# EasyEDA Pro project ProProject_MSPM0电赛_2025-06-29.epro

# Schematic Schematic1
Board Name: Board1; Create Date: 2025-06-14; Page Name: P1; Project Name: MSPM0电赛; Schematic Name: Schematic1; Update Date: 2025-06-28; Company: 嘉立创EDA; Page Size: A4; Version: V1.0
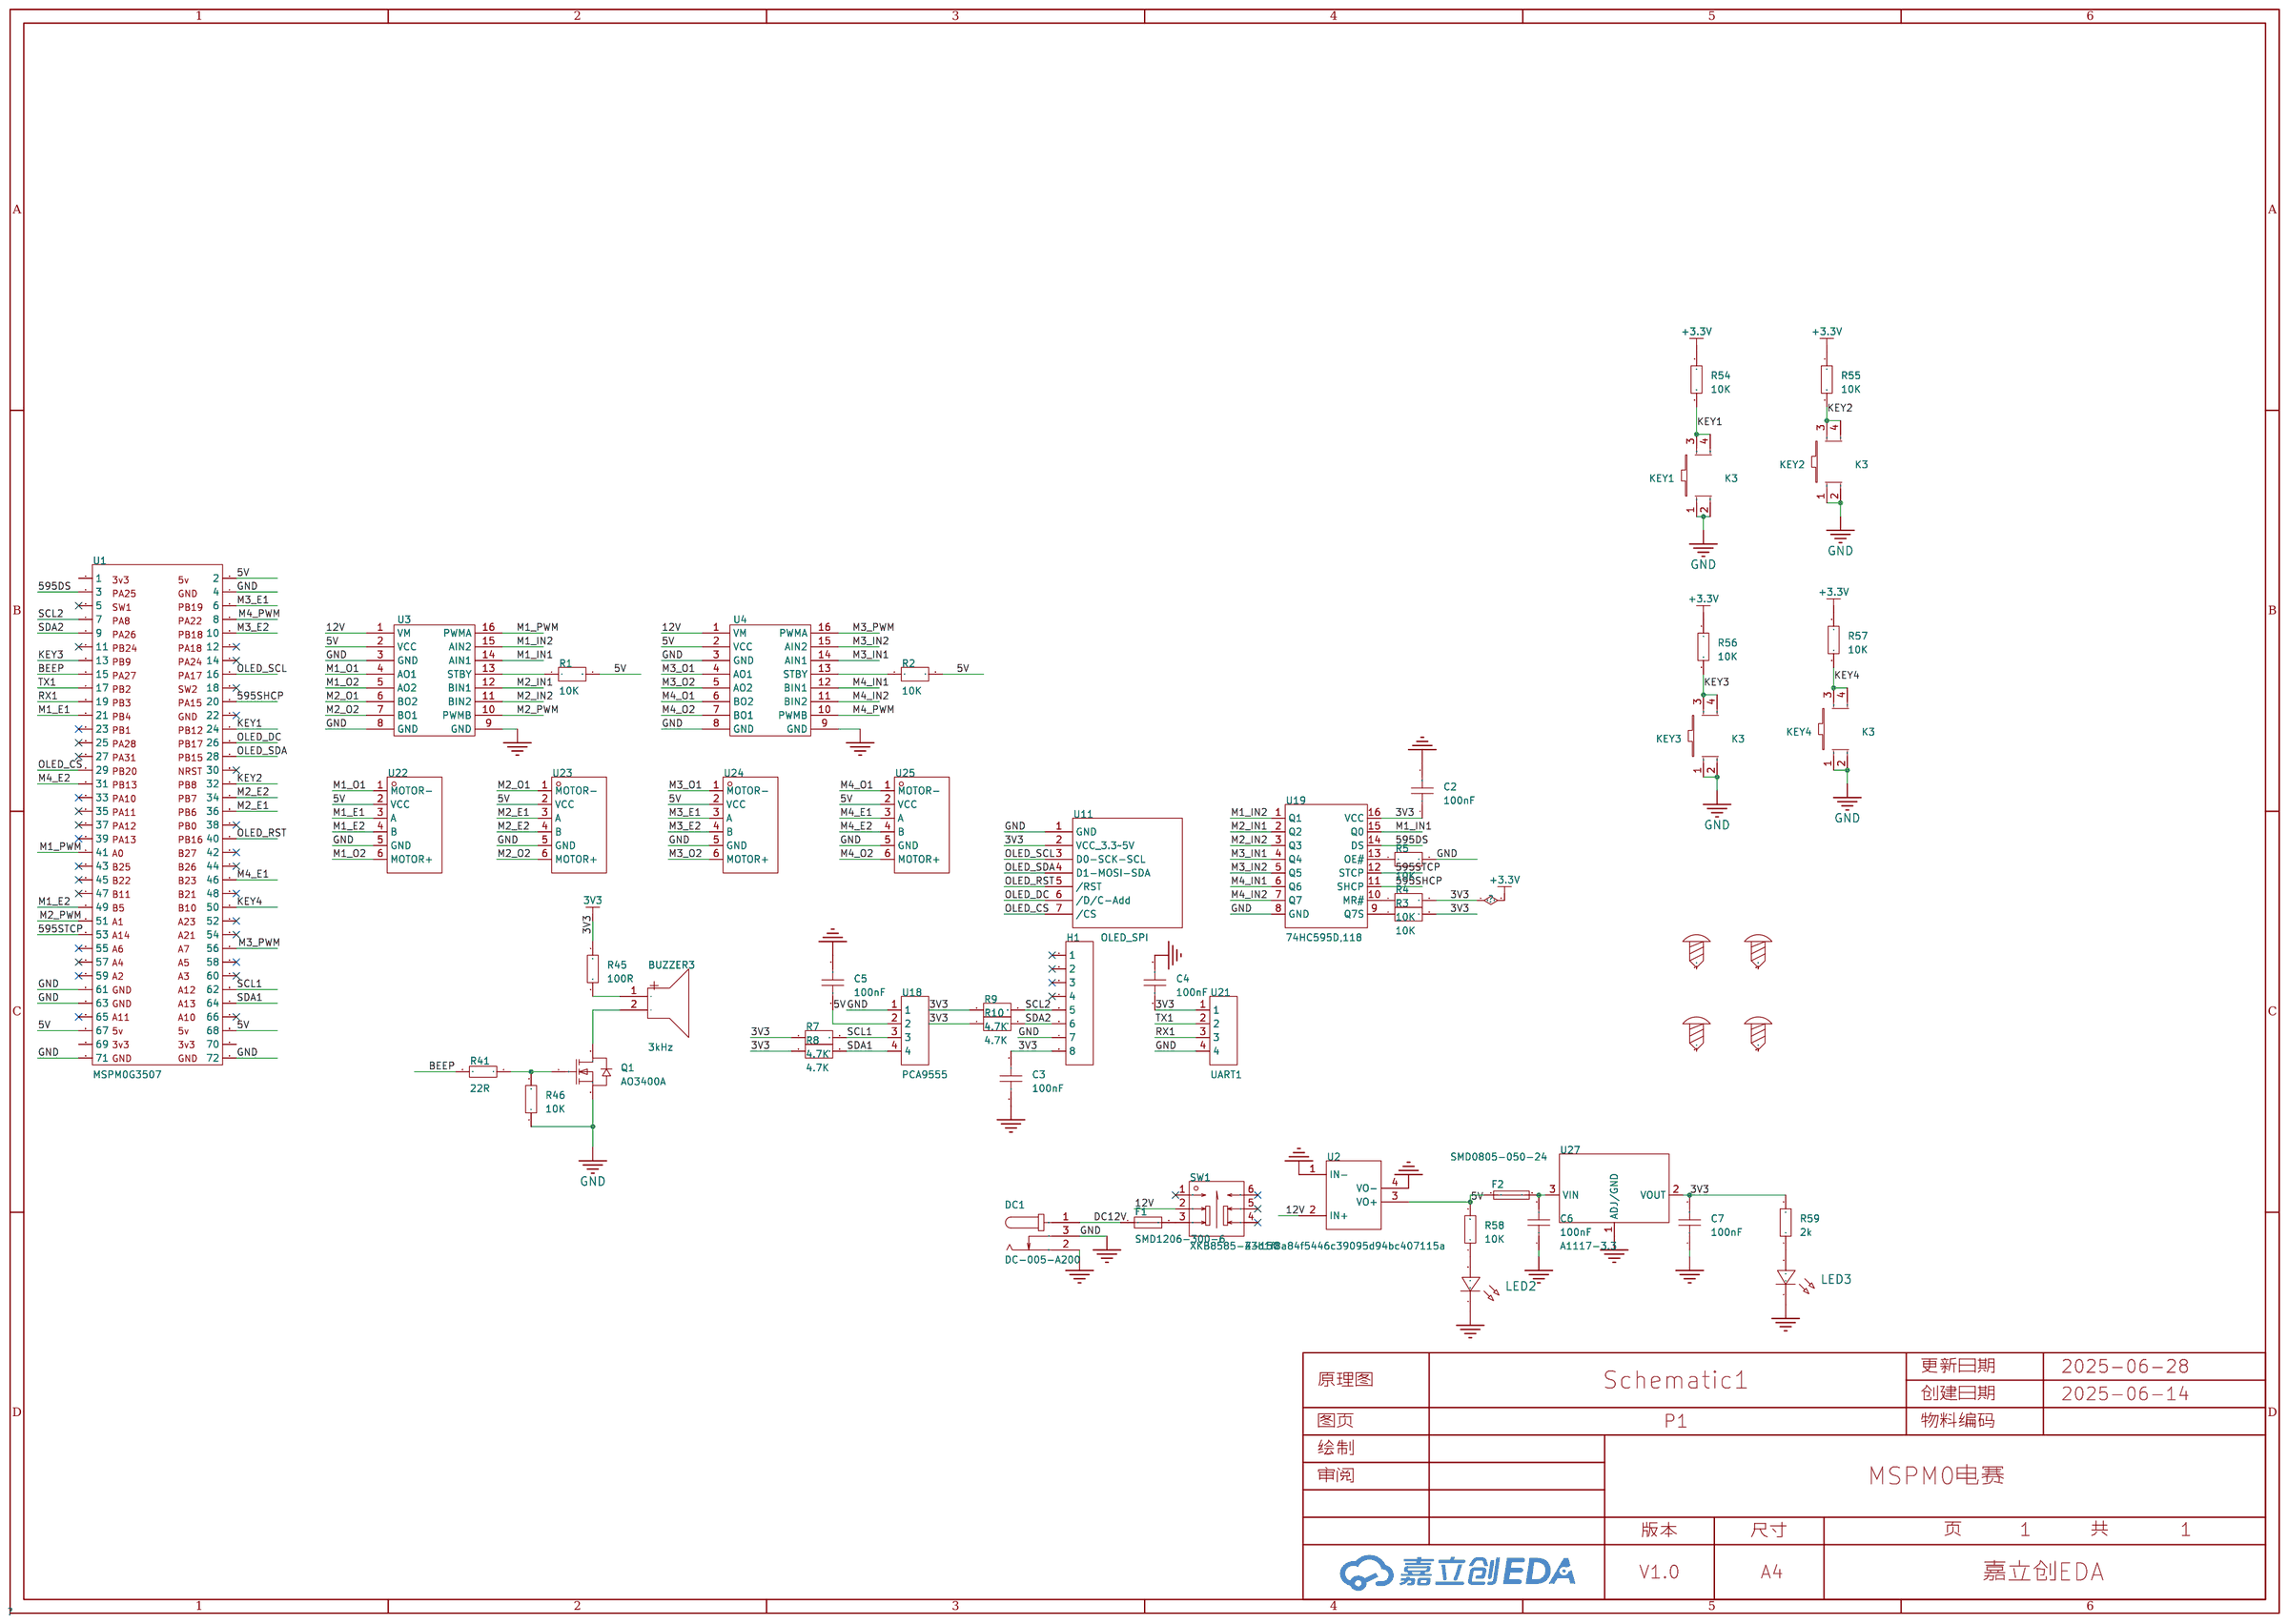
[diagram p0: schematic sheet]

## Parts
BUZZER3  3kHz  [BUZ-TH_BD9.0-P5.00-D0.6-FD]
C2  100nF  [C0603]
C3  100nF  [C0603]
C4  100nF  [C0603]
C5  100nF  [C0603]
C6  100nF  [C0603]
C7  100nF  [C0603]
DC1  DC-005-A200  [DC-IN-TH_DC-005-A200]
F1  SMD1206-300-6  [F1206]
F2  SMD0805-050-24  [F0805]
H1  -  [HDR-TH_8P-P2.54-V-F-1]
KEY1  K3  [KEY-TH_4P-L6.0-W6.0-P4.50]
KEY2  K3  [KEY-TH_4P-L6.0-W6.0-P4.50]
KEY3  K3  [KEY-TH_4P-L6.0-W6.0-P4.50]
KEY4  K3  [KEY-TH_4P-L6.0-W6.0-P4.50]
LED2  -  [LED_0603]
LED3  -  [LED_0603]
Q1  AO3400A  [SOT-23-3_L2.9-W1.3-P1.90-LS2.4-BR]
R1  10K  [C0603]
R2  10K  [C0603]
R3  10K  [C0603]
R4  10K  [C0603]
R5  10K  [C0603]
R7  4.7K  [C0603]
R8  4.7K  [C0603]
R9  4.7K  [C0603]
R10  4.7K  [C0603]
R41  22R  [R0603]
R45  100R  [R0603]
R46  10K  [R0603]
R54  10K  [R0603]
R55  10K  [R0603]
R56  10K  [R0603]
R57  10K  [R0603]
R58  10K  [R0603]
R59  2k  [R0603]
SCREW1  -  [M3螺丝]
SCREW2  -  [M3螺丝]
SCREW3  -  [M3螺丝]
SCREW4  -  [M3螺丝]
SW1  XKB8585-Z-150  [SW-TH_6P-L8.5-W8.5-P2.50-LS5.4-BL-1]
U1  MSPM0G3507  [MSPM0G3507]
U2  43b1f8a84f5446c39095d94bc407115a  [AJ41 DC-DC降压电源模块]
U3  -  [TB6612]
U4  -  [TB6612]
U11  OLED_SPI  [0.96OLED_7P]
U18  PCA9555  [CONN-TH_4P-P2.50-XH2.54-4P]
U19  74HC595D,118  [SOIC-16_L9.9-W3.9-P1.27-LS6.0-BL]
U21  UART1  [CONN-TH_4P-P2.50-XH2.54-4P]
U22  -  [ZX-XH2.54-6PWZ]
U23  -  [ZX-XH2.54-6PWZ]
U24  -  [ZX-XH2.54-6PWZ]
U25  -  [ZX-XH2.54-6PWZ]
U27  A1117-3.3  [SOT-223-3_L6.5-W3.4-P2.30-LS7.0-BR-1]

## Library data of the parts
BUZZER3 = HNB09A03: 驱动方式:有源(内含驱动线路);构造类型:电磁式;频率:3kHz;声压(SPL):85dB;; LCSC Part Name: 电磁式有源一体蜂鸣器HNB09A03; Supplier Part: C96102; Manufacturer: 华能; Supplier Footprint: 插件,D=9mm; JLCPCB Part Class: 扩展库; Datasheet: https://atta.szlcsc.com/upload/public/pdf/source/20241128/61C4C8C3938BB25F7C38FBE94CCE8DCF.pdf; Supplier: LCSC; Driver Circuitry: 有源(内含驱动线路); Technology: 电磁式; Voltage - Supply: 1.5V~4.5V; Current Consumption: 30mA; Sound Pressure Level(SPL): 85dB; Diameter(φD): 9mm; Height: 5.5mm; Operating Temperature: -20℃~+70℃
C2-C7 = CAP_0603: Supplier Footprint: 0603
DC1 = DC-005-A200: 连接器类型:DC电源插座;安装方式:弯插;触点内径:2mm;触点外径:6.4mm;额定电流:3A;额定电压:30V;工作温度范围:-20℃~+70℃;; LCSC Part Name: DC电源插座 内径:2mm 外径:6.4mm; Supplier Part: C720557; Manufacturer: XUNPU(讯普); Supplier Footprint: 插件; JLCPCB Part Class: 扩展库; Datasheet: https://atta.szlcsc.com/upload/public/pdf/source/20200812/C720557_2286DFCD6C75B71AF905731F627ABF3A.pdf; Supplier: LCSC; Connector Type: DC电源插座; Mounting Style: 弯插; Inside Contact Diameter: 2mm; Outside Contact Diameter: 6.4mm; Current Rating (Max): 3A; Voltage Rating (Max): 30V; Operating Temperature Range: -20℃~+70℃
F1 = SMD1206-300-6: 耐压(Vmax):6V;最大电流(Imax):40A;保持电流(Ihold):3A;跳闸电流(Itrip):6A;; Supplier Part: C46641035; Manufacturer: 宏嘉诚; Supplier Footprint: 1206; JLCPCB Part Class: 扩展库; Datasheet: https://atta.szlcsc.com/upload/public/pdf/source/20250414/5AC46D2F961B725C9DB708C91B04DBEC.pdf; Supplier: LCSC; Voltage - Max: 6V; Current - Max: 40A; Hold Current: 3A; Trip Current: 6A; Power Dissipation: 1W; Resistance - Initial (Ri) (Min): 10mΩ; Resistance - Post Trip (R1) (Max): 50mΩ; Time to Trip(Max): 4s
F2 = SMD0805-050-24: 耐压(Vmax):24V;最大电流(Imax):40A;保持电流(Ihold):500mA;跳闸电流(Itrip):1A;; Supplier Part: C46640987; Manufacturer: 宏嘉诚; Supplier Footprint: 0805; JLCPCB Part Class: 扩展库; Datasheet: https://atta.szlcsc.com/upload/public/pdf/source/20250414/C7C75E40B18789A4A1352E9E468D2637.pdf; Supplier: LCSC; Voltage - Max: 24V; Current - Max: 40A; Hold Current: 500mA; Trip Current: 1A; Power Dissipation: 500mW; Resistance - Initial (Ri) (Min): 100mΩ; Resistance - Post Trip (R1) (Max): 850mΩ; Time to Trip(Max): 100ms; Operating Temperature: -40℃~+85℃
H1 = HDR-F_2.54_1x8P: Supplier Part: C27438; Supplier Footprint: 插件
KEY1-KEY4 = 按键开关6*6*8.5: LCSC Part Name: 按键开关6*6*8.5   直插; Supplier Part: C59980; Supplier Footprint: 插件; JLCPCB Part Class: 扩展库; Supplier: LCSC
LED2 LED3 = LED_0603-R: Supplier Footprint: 0603
Q1 = AO3400A_C20917: 类型:1个N沟道;漏源电压(Vdss):30V;连续漏极电流(Id):5.7A;导通电阻(RDS(on)@Vgs,Id):26.5mΩ@10V,5.7A;功率(Pd):1.4W;阈值电压(Vgs(th)@Id):1.5V@250uA;; LCSC Part Name: 1个N沟道 耐压:30V 电流:5.7A; Supplier Part: C20917; Manufacturer: AOS; Supplier Footprint: SOT-23-3L; JLCPCB Part Class: 基础库; Datasheet: https://atta.szlcsc.com/upload/public/pdf/source/20140107/1457706668533.pdf; Supplier: LCSC; Type: 1个N沟道; Drain Source Voltage (Vdss): 30V; Continuous Drain Current (Id): 5.7A; Drain Source On Resistance (RDS(on)@Vgs,Id): 26.5mΩ@10V,5.7A; Power Dissipation (Pd): 1.4W; Gate Threshold Voltage (Vgs(th)@Id): 1.5V@250uA; Total Gate Charge (Qg@Vgs): 7nC@4.5V; Input Capacitance (Ciss@Vds): 630pF@15V; Operating Temperature: -55℃~+150℃@(Tj)
R1-R5 R7-R10 = RGT1608P-4990-B-T5: 电阻类型:薄膜电阻;阻值:499Ω;精度:±0.1%;功率:62.5mW;最大工作电压:100V;温度系数:±25ppm/℃;; LCSC Part Name: 薄膜电阻 499Ω ±0.1% 62.5mW; Supplier Part: C2083102; Manufacturer: SUSUMU; Supplier Footprint: 0603; JLCPCB Part Class: 扩展库; Datasheet: https://atta.szlcsc.com/upload/public/pdf/source/20210602/FAF6903AD06801EB9B5BD9535AC54790.pdf; Supplier: LCSC; Type: 薄膜电阻; Tolerance: ±0.1%; Power(Watts): 62.5mW; Overload Voltage (Max): 100V; Temperature Coefficient: ±25ppm/℃; Operating Temperature Range: -55℃~+175℃
R41 R45 R46 R54-R59 = Res_0603: Supplier Footprint: 0603
SCREW1-SCREW4 = M3螺丝: Supplier Footprint: 插件
SW1 = XKB8585-Z-150: 电路结构:-;自锁/无锁:自锁;安装方式:直插;触点电流:100mA;额定电压 (AC):250V;额定电压 (DC):30V;带灯:不带;作用力:160gf;机械寿命:10万次;; LCSC Part Name: 按键开关   六脚 内扣 有声自锁; Supplier Part: C318850; Manufacturer: XKB Connectivity(中国星坤); Supplier Footprint: 插件; JLCPCB Part Class: 扩展库; Datasheet: https://atta.szlcsc.com/upload/public/pdf/source/20200227/C318850_BEC742BC33DEE736D7E5FB22B903A157.pdf; Supplier: LCSC; Self Lock / No Lock: 自锁; Actuator Style: 方形按钮; Mounting Style: 直插; Contact Current: 100mA; Voltage Rating (AC): 250V; Voltage Rating (DC): 30V; Insulation Resistance: 100MΩ; Actuator/Cap Color: 白色; With Lamp: 不带; Pin Style: PC引脚; Operating Force: 160gf; Operating Temperature: -15℃~+55℃; Mechanical Life: 10万次
U1 = MSPM0G3507: _: 3
U2 = AJ41 DC-DC降压电源模块: AJ41 DC-DC降压电源模块 6V-36V转5V
U3 U4 = TB6612
U11 = OLED_7P: Pin Type: IN
U18 U21 = XH2.54_4P_直插: Supplier Part: C9900008616; Supplier Footprint: XH2.54_4P; JLCPCB Part Class: 扩展库; Supplier: LCSC
U19 = 74HC595D,118: 功能:串行至串行或并行;电源电压:2V~6V;元件数:1;每个元件位数:8;; LCSC Part Name: 三态输出 串行至串行或并行移位寄存器; Supplier Part: C5947; Manufacturer: Nexperia(安世); Supplier Footprint: SOIC-16; JLCPCB Part Class: 基础库; Datasheet: https://atta.szlcsc.com/upload/public/pdf/source/20240724/C3A3241CA190230F407C83CEC4244600.pdf; Supplier: LCSC; Function: 串行至串行或并行; Supply Voltage: 2V~6V; Number of Elements: 1; Number of Bits per Element: 8; Output Type: 三态; Series: 74HC; Operating Temperature: -40℃~+125℃
U22-U25 = Motor-6Pin
U27 = A1117-3.3: 输出电流:1A;; LCSC Part Name: AMS1117-3.3; Supplier Part: C7432020; Manufacturer: IDCHIP(英锐芯); Supplier Footprint: SOT-223; JLCPCB Part Class: 扩展库; Datasheet: https://atta.szlcsc.com/upload/public/pdf/source/20230625/435FEEFA02C0FE449E7397A11F8448E0.pdf; Supplier: LCSC; Output Current: 1A; Features: 热关断(TSD)；过流保护(OCP)

## Nets
5V: C5.2 F2.1 R1.2 R2.2 R58.2 U1.2 U1.67 U1.68 U2.3(VO+) U3.2(VCC) U4.2(VCC) U18.2 U22.2(VCC) U23.2(VCC) U24.2(VCC) U25.2(VCC)
12V: SW1.2 U2.2(IN+) U3.1(VM) U4.1(VM)
+3.3V: C2.1 C3.2 C4.1 C7.2 H1.8 R3.2 R4.2 R7.1 R8.1 R9.1 R10.1 R45.1 R54.1 R55.1 R56.1 R57.1 R59.2 U11.2(VCC 3.3~5V) U19.16(VCC) U21.1 U27.2(VOUT)
GND: C2.2 C3.1 C4.2 C5.1 C6.1 C7.1 DC1.2 DC1.3 H1.7 KEY1.1 KEY1.2 KEY2.1 KEY2.2 KEY3.1 KEY3.2 KEY4.1 KEY4.2 LED2.1(C) LED3.1(C) Q1.2(S) R5.2 R46.1 U1.4 U1.61 U1.63 U1.71 U1.72 U2.1(IN-) U2.4(VO-) U3.3(GND) U3.8(GND) U3.9(GND) U4.3(GND) U4.8(GND) U4.9(GND) U11.1(GND) U18.1 U19.8(GND) U21.4 U22.5(GND) U23.5(GND) U24.5(GND) U25.5(GND) U27.1(ADJ/GND)
595DS: U1.3 U19.14(DS)
595SHCP: U1.20 U19.11(SHCP)
595STCP: U1.53 U19.12(STCP)
BEEP: R41.2 U1.15
DC12V: DC1.1 F1.1
KEY1: KEY1.3 KEY1.4 R54.2 U1.24
KEY2: KEY2.3 KEY2.4 R55.2 U1.32
KEY3: KEY3.3 KEY3.4 R56.2 U1.13
KEY4: KEY4.3 KEY4.4 R57.2 U1.50
M1_E1: U1.21 U22.3(A)
M1_E2: U1.49 U22.4(B)
M1_IN1: U3.14(AIN1) U19.15(Q0)
M1_IN2: U3.15(AIN2) U19.1(Q1)
M1_O1: U3.4(AO1) U22.1(MOTOR-)
M1_O2: U3.5(AO2) U22.6(MOTOR+)
M1_PWM: U1.41 U3.16(PWMA)
M2_E1: U1.36 U23.3(A)
M2_E2: U1.34 U23.4(B)
M2_IN1: U3.12(BIN1) U19.2(Q2)
M2_IN2: U3.11(BIN2) U19.3(Q3)
M2_O1: U3.6(BO2) U23.1(MOTOR-)
M2_O2: U3.7(BO1) U23.6(MOTOR+)
M2_PWM: U1.51 U3.10(PWMB)
M3_E1: U1.6 U24.3(A)
M3_E2: U1.10 U24.4(B)
M3_IN1: U4.14(AIN1) U19.4(Q4)
M3_IN2: U4.15(AIN2) U19.5(Q5)
M3_O1: U4.4(AO1) U24.1(MOTOR-)
M3_O2: U4.5(AO2) U24.6(MOTOR+)
M3_PWM: U1.56 U4.16(PWMA)
M4_E1: U1.46 U25.3(A)
M4_E2: U1.31 U25.4(B)
M4_IN1: U4.12(BIN1) U19.6(Q6)
M4_IN2: U4.11(BIN2) U19.7(Q7)
M4_O1: U4.6(BO2) U25.1(MOTOR-)
M4_O2: U4.7(BO1) U25.6(MOTOR+)
M4_PWM: U1.8 U4.10(PWMB)
OLED_CS: U1.29 U11.7(/CS)
OLED_DC: U1.26 U11.6(/D/C-Add)
OLED_RST: U1.40 U11.5(/RST)
OLED_SCL: U1.16 U11.3(D0-SCK-SCL)
OLED_SDA: U1.28 U11.4(D1-MOSI-SDA)
RX1: U1.19 U21.3
SCL1: R7.2 U1.62 U18.3
SCL2: H1.5 R9.2 U1.7
SDA1: R8.2 U1.64 U18.4
SDA2: H1.6 R10.2 U1.9
TX1: U1.17 U21.2
$1N3300: R1.1 U3.13(STBY)
$1N3306: R2.1 U4.13(STBY)
$1N3954: R3.1 U19.9(Q7S)
$1N3999: R4.1 U19.10(MR#)
$1N4038: R5.1 U19.13(OE#)
$1N7178: Q1.1(G) R41.1 R46.2
$1N9172: LED2.2(A) R58.1
$1N14610: F1.2 SW1.3
$1N14720: BUZZER3.1(+) R45.2
$1N14723: BUZZER3.2(-) Q1.3(D)
$1N15095: LED3.2(A) R59.1
$1N17140: C6.2 F2.2 U27.3(VIN)

Not connected (* = marked no-connect by the designer): H1 1* 2* 3* 4*; SCREW1 1; SCREW2 1; SCREW3 1; SCREW4 1; SW1 1* 4* 5* 6*; U1 1 5* 11* 12* 14* 18* 22* 23* 25* 27* 30* 33* 35* 37* 38* 39* 42* 43* 44* 45* 47* 48* 52* 54* 55* 57* 58* 59* 60* 65* 66* 69 70

# Board PCB1
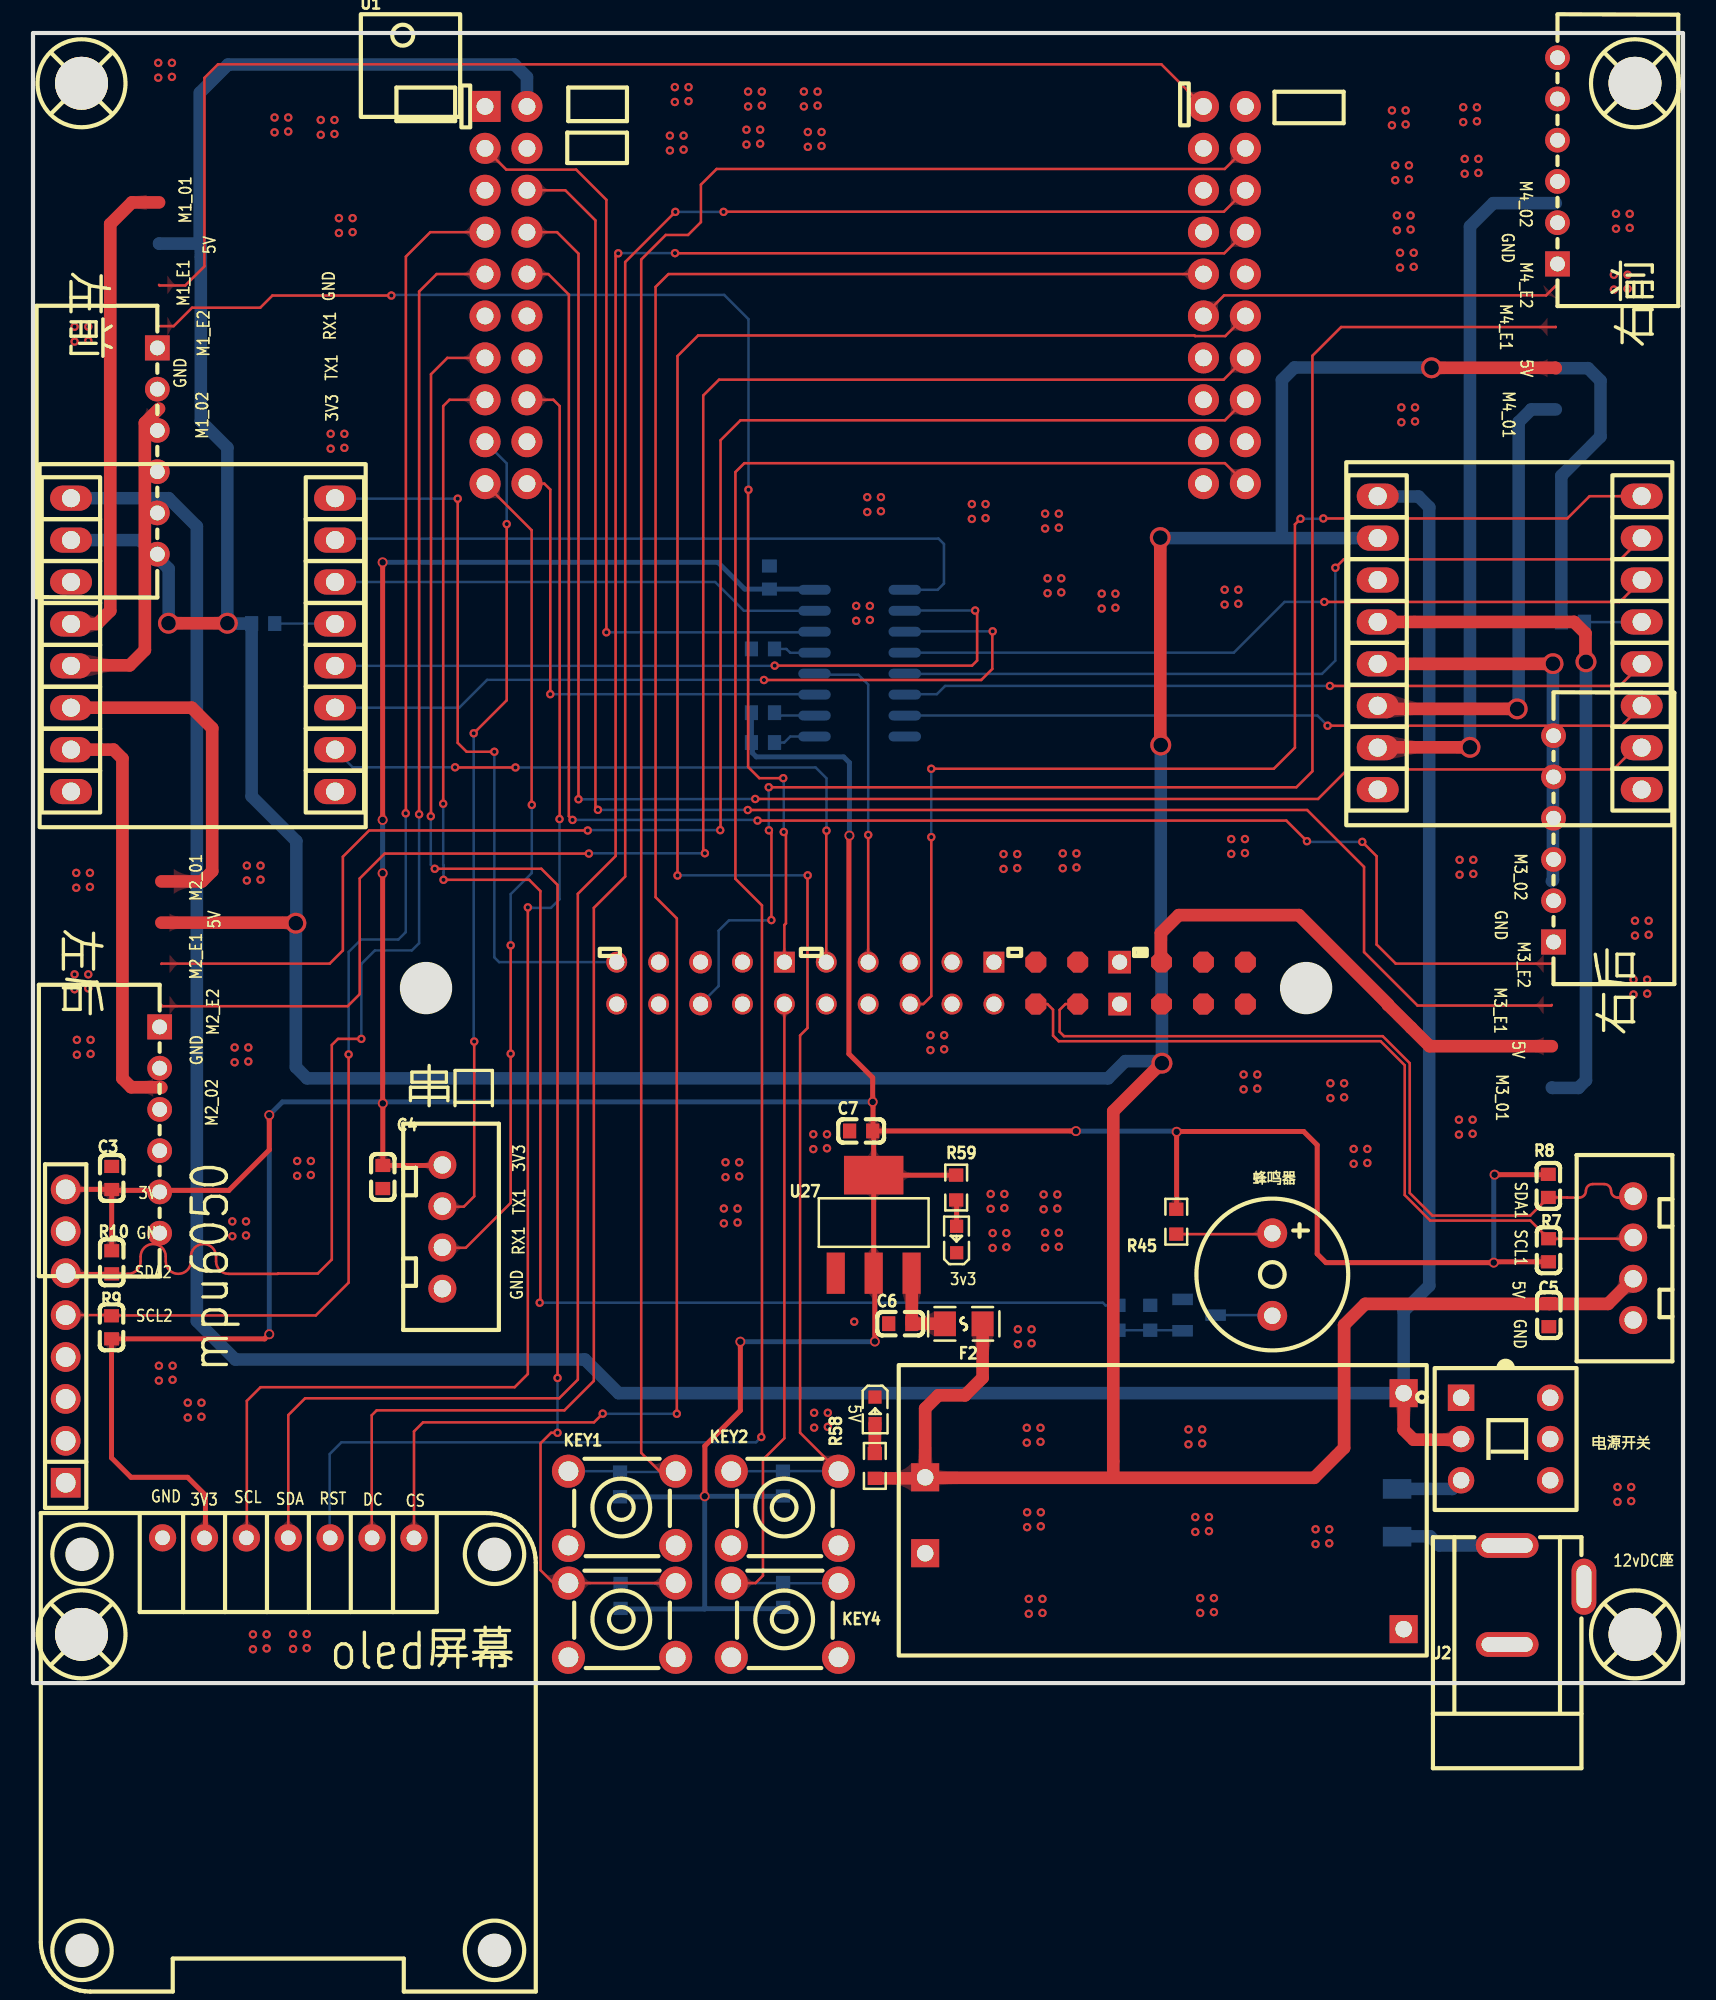
[diagram p1: board, top side]
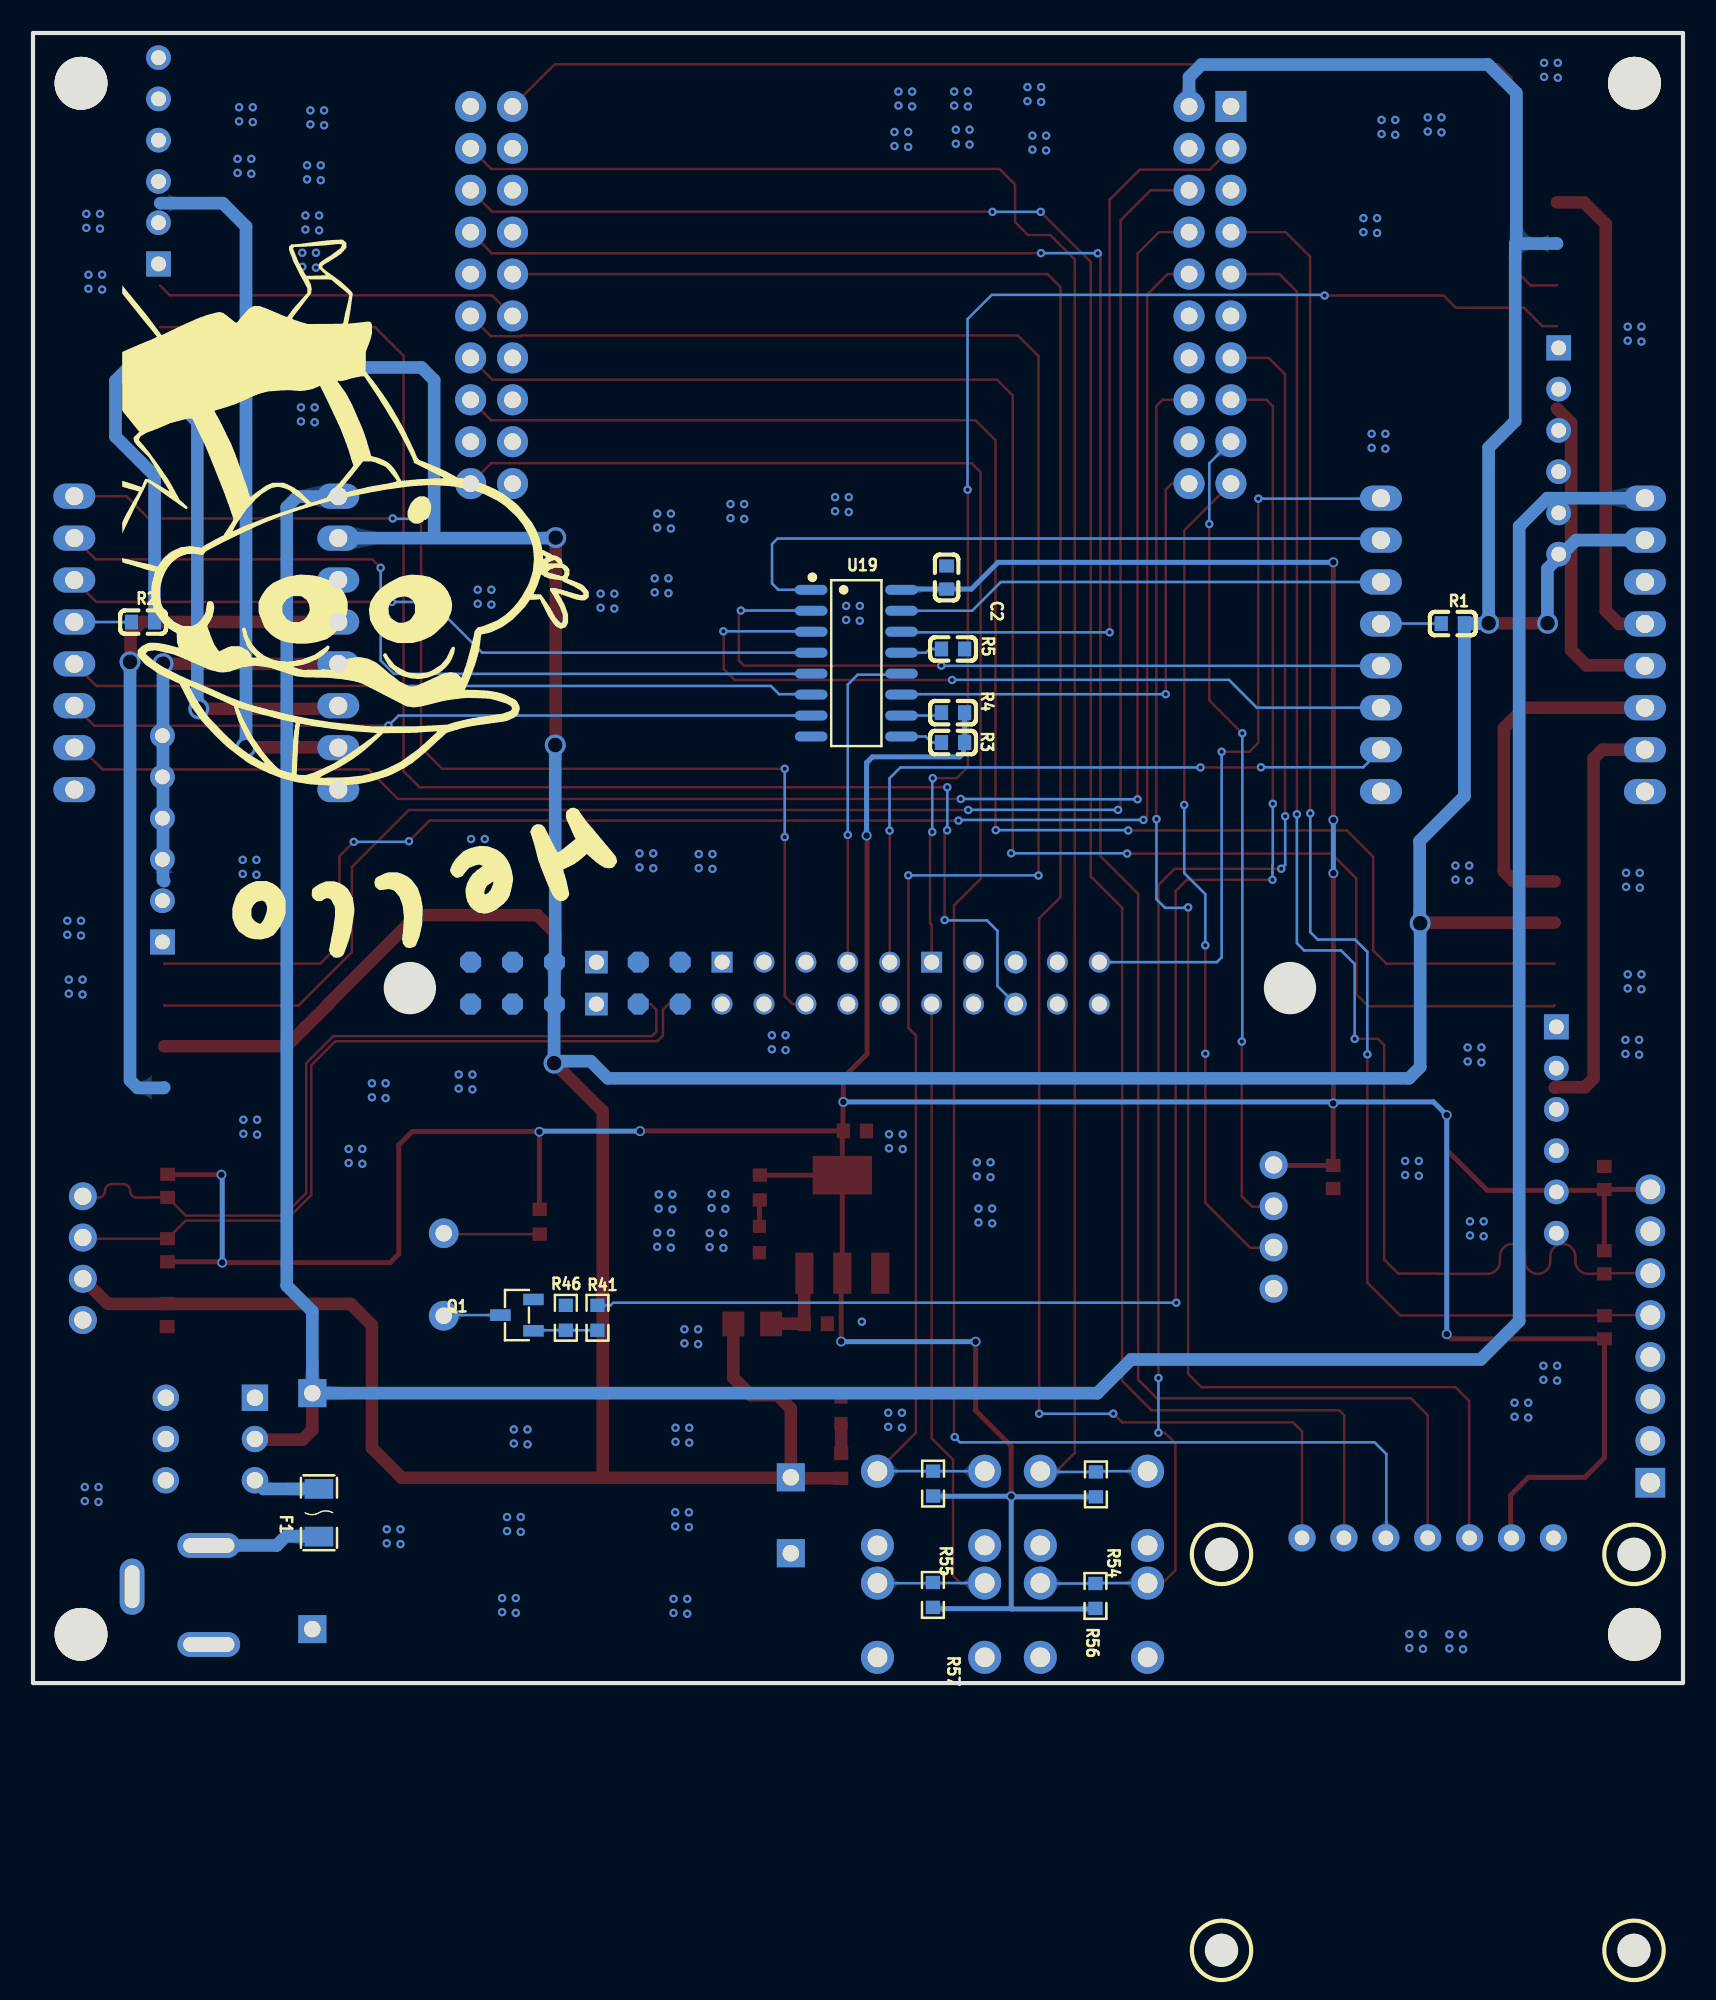
[diagram p2: board, bottom side, seen from below]

Outline 100 x 117.21 mm; copper layers: Top Layer, Bottom Layer. Coordinates in mm from the lower left corner of the outline.
Outline path: rectangle 0,117.21 100,17.21
Stack: Top Layer 0.035mm / Dielectric1 1.51mm FR4 er 4.5 / Bottom Layer 0.035mm

## Design rules (mm)
net SCL2: DP1
net SDA2: DP1
net GND: GND
net 5V: PPWO
net SCL1: DP2
net SDA1: DP2
net 12V: PPWO
net M1_O2: PPWO
net M1_O1: PPWO
net M2_O2: PPWO
net M2_O1: PPWO
net M3_O2: PPWO
net M3_O1: PPWO
net M4_O2: PPWO
net M4_O1: PPWO
net +3.3V: PWO
net $1N9172: PPWO
net DC12V: PPWO
net $1N14610: PPWO
net $1N15095: PWO
net $1N17140: PPWO
template: 常用
spacing copperThickness1oz (default): track to track 0.203, other pairs 0.152 to 0.203
spacing copperThickness2oz: track to track 0.203, other pairs 0.152 to 0.3
track width 信号线 (default): min 0.152, default 0.152, max 0.152
track width 12v和5电源线: min 0.762, default 0.762, max 0.762
track width 3v3: min 0.3, default 0.3, max 0.4
differential pair differentialPair (default): width min 0.152, default 0.152, max 0.152; gap min 0.152, default 0.152
via 信号线孔 (default): diameter min 0.508, default 0.508, max 0.508; hole min 0.254, default 0.254, max 0.305
via 12v和5v电源: diameter min 0.762, default 1.27, max 2.032; hole min 0.762, default 0.889, max 2.032
via 3v3: diameter min 0.4, default 0.6, max 1; hole min 0.4, default 0.4, max 0.6
net class PPWO uses 12v和5v电源, 12v和5电源线
net class PWO uses 3v3
net 5V uses 12v和5v电源, 12v和5电源线
net 12V uses 12v和5v电源, 12v和5电源线
net M1_O2 uses 12v和5v电源, 12v和5电源线
net M1_O1 uses 12v和5v电源, 12v和5电源线
net M2_O2 uses 12v和5v电源, 12v和5电源线
net M2_O1 uses 12v和5v电源, 12v和5电源线
net M3_O2 uses 12v和5v电源, 12v和5电源线
net M3_O1 uses 12v和5v电源, 12v和5电源线
net M4_O2 uses 12v和5v电源, 12v和5电源线
net M4_O1 uses 12v和5v电源, 12v和5电源线
net +3.3V uses 3v3
net $1N9172 uses 12v和5v电源, 12v和5电源线
net DC12V uses 12v和5v电源, 12v和5电源线
net $1N14610 uses 12v和5v电源, 12v和5电源线
net $1N15095 uses 3v3
net $1N17140 uses 12v和5v电源, 12v和5电源线

## Placement (name value [footprint] x y rotation side)
BUZZER3  3kHz  [BUZ-TH_BD9.0-P5.00-D0.6-FD]  75.11 41.97 270 top
C2  100nF  [C0603]  44.63 84.21 90 bottom
C3  100nF  [C0603]  4.77 47.82 270 top
C4  100nF  [C0603]  21.2 47.88 270 top
C5  100nF  [C0603]  91.87 39.51 90 top
C6  100nF  [C0603]  52.56 38.99 0 top
C7  100nF  [C0603]  50.19 50.67 0 top
DC1  DC-005-A200  [DC-IN-TH_DC-005-A200]  91.67 22.55 90 top
F1  SMD1206-300-6  [F1206]  82.67 27.53 90 bottom
F2  SMD0805-050-24  [F0805]  56.41 38.98 180 top
H1  -  [HDR-TH_8P-P2.54-V-F-1]  1.98 38.24 90 top
KEY1  K3  [KEY-TH_4P-L6.0-W6.0-P4.50]  35.7 27.8 0 top
KEY2  K3  [KEY-TH_4P-L6.0-W6.0-P4.50]  45.57 27.8 0 top
KEY3  K3  [KEY-TH_4P-L6.0-W6.0-P4.50]  35.7 21.02 0 top
KEY4  K3  [KEY-TH_4P-L6.0-W6.0-P4.50]  45.57 21.02 0 top
LED2  -  [LED_0603]  51.04 33.69 270 top
LED3  -  [LED_0603]  55.97 44.14 90 top
Q1  AO3400A  [SOT-23-3_L2.9-W1.3-P1.90-LS2.4-BR]  70.67 39.51 180 bottom
R1  10K  [C0603]  13.95 81.42 180 bottom
R2  10K  [C0603]  93.33 81.51 180 bottom
R3  10K  [C0603]  44.24 74.21 180 bottom
R4  10K  [C0603]  44.24 76.02 180 bottom
R5  10K  [C0603]  44.24 79.88 180 bottom
R7  4.7K  [C0603]  91.85 43.44 90 top
R8  4.7K  [C0603]  91.84 47.34 270 top
R9  4.7K  [C0603]  4.76 38.77 90 top
R10  4.7K  [C0603]  4.77 42.71 270 top
R41  22R  [R0603]  65.79 39.34 90 bottom
R45  100R  [R0603]  69.29 45.17 270 top
R46  10K  [R0603]  67.71 39.34 270 bottom
R54  10K  [R0603]  35.58 29.25 90 bottom
R55  10K  [R0603]  45.45 29.3 90 bottom
R56  10K  [R0603]  35.61 22.49 90 bottom
R57  10K  [R0603]  45.46 22.55 90 bottom
R58  10K  [R0603]  51.02 30.37 270 top
R59  2k  [R0603]  55.95 47.24 90 top
SCREW1  -  [M3螺丝]  2.94 20.16 0 top
SCREW2  -  [M3螺丝]  97.09 20.16 0 top
SCREW3  -  [M3螺丝]  2.94 114.16 0 top
SCREW4  -  [M3螺丝]  97.09 114.16 0 top
SW1  XKB8585-Z-150  [SW-TH_6P-L8.5-W8.5-P2.50-LS5.4-BL-1]  89.25 32 270 top
U1  -  [MSPM0G3507]  47.81 87.87 0 top
U2  43b1f8a84f5446c39095d94bc407115a  [AJ41 DC-DC降压电源模块]  69.17 28.28 180 top
U3  -  [TB6612]  0.25 69.03 0 top
U4  -  [TB6612]  79.44 69.15 0 top
U11  OLED_SPI  [0.96OLED_7P]  15.47 26.01 0 top
U18  PCA9555  [CONN-TH_4P-P2.50-XH2.54-4P]  96.98 42.96 270 top
U19  74HC595D,118  [SOIC-16_L9.9-W3.9-P1.27-LS6.0-BL]  50.1 79.02 270 bottom
U21  UART1  [CONN-TH_4P-P2.50-XH2.54-4P]  24.81 44.86 90 top
U22  -  [ZX-XH2.54-6PWZ]  7.64 100.7 270 top
U23  -  [ZX-XH2.54-6PWZ]  7.78 59.55 270 top
U24  -  [ZX-XH2.54-6PWZ]  92.05 59.55 90 top
U25  -  [ZX-XH2.54-6PWZ]  92.29 100.64 90 top
U27  A1117-3.3  [SOT-223-3_L6.5-W3.4-P2.30-LS7.0-BR-1]  50.95 45.02 270 top

## Footprints (pads in the part's own frame, mm; a bottom-side part is the same pattern mirrored in y, then rotated)
0.96OLED_7P
  round 1.651 hole 0.889: 1(-7.617,0.003) 2(-5.077,-0.003) 3(-2.538,-0.003) 4(0.003,0.005) 5(2.54,0) 6(5.08,0) 7(7.62,-0.003)
AJ41 DC-DC降压电源模块
  rect 1.7x1.7 hole 1: 1(-13.9,7.8) 2(-13.9,-6.5) 3(15.1,-1.4) 4(15.1,3.2)
BUZ-TH_BD9.0-P5.00-D0.6-FD
  round 1.8 hole 1: 1(-2.5,0) 2(2.5,0)
C0603
  rect 0.8x0.9 smd: 1(-0.7,0) 2(0.7,0)
CONN-TH_4P-P2.50-XH2.54-4P
  round 1.7 hole 1.05: 1(3.75,0) 2(1.25,0) 3(-1.25,0) 4(-3.75,0)
DC-IN-TH_DC-005-A200
  oval 1.5x3.8 hole 0.9x3.1: 1(3,2.325) 2(-3,2.325)
  oval 3.4x1.5 hole 2.6x0.9: 3(0.5,-2.325)
F0805
  rect 1.335x1.5 smd: 1(-1.143,0) 2(1.143,0)
F1206
  rect 1.19x1.728 smd: 1(-1.445,0) 2(1.445,0)
HDR-TH_8P-P2.54-V-F-1
  rect 1.8x1.8 hole 1.2: 1(-8.89,0)
  round 1.8 hole 1.2: 2(-6.35,0) 3(-3.81,0) 4(-1.27,0) 5(1.27,0) 6(3.81,0) 7(6.35,0) 8(8.89,0)
KEY-TH_4P-L6.0-W6.0-P4.50
  round 2 hole 1.2: 1(-3.25,-2.25) 2(3.25,-2.25) 3(3.25,2.25) 4(-3.25,2.25)
LED_0603
  rect 0.8x0.8 smd: 1(-0.851,-0.01) 2(0.75,-0.005)
M3螺丝
  round 3.2 hole 3.2: 1(0,0)
MSPM0G3507
  rect 1.879x1.879 hole 1.021x1.016: 1(-20.412,24.892)
  round 1.879 hole 1.021x1.016: 2(-17.872,24.892) 3(-20.412,22.352) 4(-17.872,22.352) 5(-20.412,19.812) 6(-17.872,19.812) 7(-20.412,17.272) 8(-17.872,17.272) 9(-20.412,14.732) 10(-17.872,14.732) 11(-20.412,12.192) 12(-17.872,12.192) 13(-20.412,9.652) 14(-17.872,9.652) 15(-20.412,7.112) 16(-17.872,7.112) 17(-20.412,4.572) 18(-17.872,4.572) 19(-20.412,2.032) 20(-17.872,2.032) 21(23.128,24.892) 22(25.668,24.892) 23(23.128,22.352) 24(25.668,22.352) 25(23.128,19.812) 26(25.668,19.812) 27(23.128,17.272) 28(25.668,17.272) 29(23.128,14.732) 30(25.668,14.732) 31(23.128,12.192) 32(25.668,12.192) 33(23.128,9.652) 34(25.668,9.652) 35(23.128,7.112) 36(25.668,7.112) 37(23.128,4.572) 38(25.668,4.572) 39(23.128,2.032) 40(25.668,2.032)
  round 1.267 hole 0.919x0.914: 41(-12.431,-26.968) 42(-12.431,-29.508) 43(-9.892,-26.968) 44(-9.892,-29.508) 47(-4.811,-26.968) 48(-4.811,-29.508) 50(-2.272,-29.508) 51(0.269,-26.968) 52(0.269,-29.508) 53(2.808,-26.968) 54(2.808,-29.508) 55(5.348,-26.968) 56(5.348,-29.508) 57(7.888,-26.968) 58(7.888,-29.508) 60(10.428,-29.508)
  round 1.371 hole 0.919x0.914: 45(-7.351,-26.968) 46(-7.351,-29.508)
  rect 1.267x1.267 hole 0.919x0.914: 49(-2.272,-26.968) 59(10.428,-26.968)
  custom 1.268x1.267 hole 0.919x0.914: 61(12.969,-26.968) 62(12.969,-29.508) 63(15.508,-26.968) 64(15.508,-29.508) 67(20.588,-26.968) 68(20.588,-29.508) 69(23.128,-26.968) 70(23.128,-29.508) 72(25.669,-29.508)
  rect 1.371x1.371 hole 0.919x0.914: 65(18.049,-26.968) 66(18.049,-29.508)
  custom 1.268x1.267 hole 0.914x0.919: 71(25.668,-26.968)
R0603
  rect 0.806x0.864 smd: 1(-0.753,0) 2(0.753,0)
SOIC-16_L9.9-W3.9-P1.27-LS6.0-BL
  oval 0.602x1.971 smd: 1(-4.445,-2.736) 2(-3.175,-2.736) 3(-1.905,-2.736) 4(-0.635,-2.736) 5(0.635,-2.736) 6(1.905,-2.736) 7(3.175,-2.736) 8(4.445,-2.736) 9(4.445,2.736) 10(3.175,2.736) 11(1.905,2.736) 12(0.635,2.736) 13(-0.635,2.736) 14(-1.905,2.736) 15(-3.175,2.736) 16(-4.445,2.736)
SOT-23-3_L2.9-W1.3-P1.90-LS2.4-BR
  rect 1.25x0.7 smd: 1(1,-0.95) 2(1,0.95) 3(-1,0)
SOT-223-3_L6.5-W3.4-P2.30-LS7.0-BR-1
  rect 2.5x1.1 smd: 1(2.97,-2.3) 2(2.97,0) 3(2.97,2.3)
  rect 2.34x3.6 smd: 2(-2.97,0)
SW-TH_6P-L8.5-W8.5-P2.50-LS5.4-BL-1
  rect 1.6x1.6 hole 1: 1(-2.5,-2.7)
  round 1.6 hole 1: 2(0,-2.7) 3(2.5,-2.7) 4(2.5,2.7) 5(0.001,2.7) 6(-2.5,2.7)
TB6612
  oval 2.54x1.524 hole 1.1: 1(2.057,19.988) 2(2.057,17.448) 3(2.057,14.908) 4(2.057,12.368) 5(2.057,9.828) 6(2.057,7.288) 7(2.057,4.748) 8(2.057,2.208) 9(18.057,2.208) 10(18.057,4.748) 11(18.057,7.288) 12(18.057,9.828) 13(18.057,12.368) 14(18.057,14.908) 15(18.057,17.448) 16(18.057,19.988)
ZX-XH2.54-6PWZ
  rect 1.524x1.5 hole 0.9: 1(2.575,-0.104)
  round 1.5 hole 0.9: 2(5.074,-0.104) 3(7.574,-0.104) 4(10.075,-0.104) 5(12.575,-0.104) 6(15.075,-0.104)

## Nets
As in the schematic.

Pads without a net: H1 1 2 3 4; SCREW1 1; SCREW2 1; SCREW3 1; SCREW4 1; SW1 1 4 5 6; U1 1 5 11 12 14 18 22 23 25 27 30 33 35 37 38 39 42 43 44 45 47 48 52 54 55 57 58 59 60 65 66 69 70

## Via types
v1: diameter 0.508, hole 0.254, Top Layer to Bottom Layer, 336 vias
v2: diameter 1.27, hole 0.889, Top Layer to Bottom Layer, 11 vias
v3: diameter 0.6, hole 0.4, Top Layer to Bottom Layer, 15 vias

## Routing (per net, layer and track width the routed paths; a pad name or vN(x,y) marks a point on that pad's centre or on a via; arc(x,y) is an arc through that point)
5V: length 375.2
  Top Layer w0.762: 7.78,63.29 15.9,63.29 v2(15.93,63.26) ; 91.89,40.19 95.46,40.19 U18.2 ; 91.89,40.19 80.74,40.19 79.46,38.91 79.46,31.46 77.65,29.65 54.07,29.65 ; 91.89,40.19 C5.2 ; v2(8.21,81.44) v2(11.78,81.44) ; 83.53,56.92 84.64,55.8 92.05,55.8 ; 83.53,56.92 82.13,58.31 82.11,58.31 ; 83.53,56.92 83.51,56.94 ; 65.44,29.71 65.47,29.74 65.47,30.63 ; 51.02,29.61 54.01,29.61 U2.3 54.07,33.85 54.87,34.65 56.49,34.65 57.55,35.71 F2.1 ; v2(68.35,74.06) 68.32,74.09 v2(68.32,86.63) ; 82.13,58.34 76.72,63.75 69.44,63.75 68.36,62.67 68.36,60.93 68.4,60.9 ; 92.29,96.89 92.27,96.92 v2(84.76,96.92) ; v2(68.42,54.78) 68.39,54.78 65.47,51.86 65.47,30.66
  Bottom Layer w0.762: 10.1,104.45 10.16,104.45 10.17,103.6 ; 10.1,104.45 7.65,104.45 7.64,104.44 ; 10.1,104.45 10.1,113.58 ; 10.1,104.45 10.1,104.32 ; 29.94,112.76 29.94,114.54 29.18,115.3 11.82,115.3 10.13,113.61 ; 92.29,96.89 94.24,96.89 95,96.14 95,92.75 92.63,90.38 R2.2 ; v2(68.32,86.63) 68.35,86.6 U4.2 ; v2(84.76,96.92) 84.74,96.94 76.45,96.94 75.69,96.18 75.69,86.75 ; v2(8.21,81.44) 8.22,81.45 8.22,84.74 6.48,86.48 U3.2 ; v2(68.35,74.06) 68.35,60.94 68.4,60.9 68.4,58.36 68.42,58.33 v2(68.42,54.78) 68.3,54.9 66.2,54.9 65.16,53.86 16.61,53.86 15.93,54.54 v2(15.93,63.26) 15.96,63.29 15.96,68.24 13.25,70.95 R1.2 11.8,81.42 v2(11.78,81.44) 11.78,92.08 10.17,93.69 10.17,103.64
12V: length 195.1
  Top Layer w0.762: SW1.2 86.51,31.96 83.67,31.96 83.07,32.56 U2.2
  Bottom Layer w0.762: U3.1 8.22,89.02 9.93,87.31 9.93,39.15 12.26,36.82 33.45,36.82 35.49,34.78 U2.2 83.07,39.74 84.62,41.29 84.62,88.47 83.97,89.12 81.51,89.12 U4.1
+3.3V: length 318.4
  Top Layer w0.3: H1.8 4.76,47.13 C3.2 ; U21.1 24.78,48.58 C4.1 v3(21.2,52.34) 21.2,52.35 21.16,52.39 ; C3.2 4.82,47.07 11.87,47.07 14.32,49.52 v3(14.32,51.63) ; C3.2 R10.1 ; 50.94,50.67 63.2,50.67 v3(63.21,50.66) ; 50.94,50.67 50.95,50.66 U27.2 ; 50.94,50.67 C7.2 ; 50.94,50.67 50.91,50.7 50.91,52.41 v3(50.89,52.43) 50.89,53.9 49.45,55.34 49.45,68.54 v3(49.48,68.57) ; 21.18,52.39 21.19,52.4 v3(21.19,66.29) ; U27.2 U27.2 51.02,41.98 v3(51.02,37.91) ; U27.2 55.95,47.99 R59.2 ; R8.1 91.82,48.02 v3(88.58,48.02) ; U11.2 10.45,26.06 10.45,28.6 9.37,29.68 5.94,29.68 4.76,30.86 R9.1 14.04,38.07 v3(14.32,38.35) ; v3(21.19,85.13) v3(21.19,69.52) ; v3(42.87,37.9) 42.87,33.73 40.72,31.58 40.72,28.54 v3(40.71,28.53) ; R45.1 69.31,45.94 v3(69.31,50.62) 69.33,50.64 77.01,50.64 77.83,49.82 77.83,43.22 78.36,42.69 v3(88.53,42.69) 88.58,42.74 R7.1
  Bottom Layer w0.3: v3(40.71,28.53) 40.68,28.49 35.58,28.49 ; v3(40.71,28.53) 40.71,21.72 ; v3(40.71,28.53) 45.43,28.53 R55.1 ; 40.71,21.72 45.38,21.72 45.46,21.79 ; 40.71,21.72 40.63,21.72 ; 40.71,21.72 40.71,21.7 35.65,21.7 35.61,21.73 ; v3(88.58,48.02) 88.53,47.97 v3(88.53,42.69) ; 43.6,74.09 43.6,73.58 43.84,73.34 49.13,73.34 49.48,72.99 ; 49.48,72.99 v3(49.48,68.57) ; 49.48,72.99 49.49,72.98 ; R4.2 R3.2 ; v3(51.02,37.91) 51.01,37.9 v3(42.87,37.9) ; v3(63.21,50.66) 69.27,50.66 v3(69.31,50.62) ; v3(50.89,52.43) 15.12,52.43 v3(14.32,51.63) v3(14.32,38.35) ; v3(21.19,69.52) v3(21.19,66.29) ; v3(21.19,85.13) 41.51,85.13 43.13,83.51 C2.1 47.32,83.51 U19.16
GND:
  vias: v1(2.52,99.41) v1(2.52,98.51) v1(2.52,60.16) v1(2.52,59.26) v1(2.62,66.31) v1(2.62,65.41) v1(2.66,56.19) v1(2.66,55.29) v1(3.35,99.41) v1(3.35,98.56) v1(3.35,60.16) v1(3.35,59.31) v1(3.45,66.31) v1(3.45,65.46) v1(3.49,56.19) v1(3.49,55.34) v1(7.59,115.4) v1(7.59,114.5) v1(7.63,36.44) v1(7.63,35.54) v1(8.42,115.4) v1(8.42,114.55) v1(8.46,36.44) v1(8.46,35.59) v1(9.38,34.2) v1(9.38,33.3) v1(10.21,34.2) v1(10.21,33.35) v1(12.08,45.19) v1(12.08,44.29) v1(12.22,55.73) v1(12.22,54.83) v1(12.91,45.19) v1(12.91,44.34) v1(12.96,66.75) v1(12.96,65.85) v1(13.05,55.73) v1(13.05,54.88) v1(13.33,20.16) v1(13.33,19.26) v1(13.79,66.75) v1(13.79,65.9) v1(14.16,20.16) v1(14.16,19.31) v1(14.64,112.09) v1(14.64,111.19) v1(15.47,112.09) v1(15.47,111.24) v1(15.76,20.18) v1(15.76,19.28) v1(16.01,48.85) v1(16.01,47.95) v1(16.59,20.18) v1(16.59,19.33) v1(16.84,48.85) v1(16.84,48) v1(17.44,111.94) v1(17.44,111.04) v1(18.04,92.92) v1(18.04,92.02) v1(18.27,111.94) v1(18.27,111.09) v1(18.54,105.99) v1(18.54,105.09) v1(18.87,92.92) v1(18.87,92.07) v1(19.37,105.99) v1(19.37,105.14) v1(38.6,110.99) v1(38.6,110.09) v1(38.9,113.93) v1(38.9,113.03) v1(39.43,110.99) v1(39.43,110.14) v1(39.73,113.93) v1(39.73,113.08) v1(41.87,45.97) v1(41.87,45.07) v1(41.97,48.77) v1(41.97,47.87) v1(42.7,45.97) v1(42.7,45.12) v1(42.8,48.77) v1(42.8,47.92) v1(43.24,111.35) v1(43.24,110.45) v1(43.34,113.66) v1(43.34,112.76) v1(44.07,111.35) v1(44.07,110.5) v1(44.17,113.66) v1(44.17,112.81) v1(46.72,113.66) v1(46.72,112.76) v1(46.96,111.21) v1(46.96,110.31) v1(47.29,50.47) v1(47.29,49.57) v1(47.34,33.59) v1(47.34,32.69) v1(47.55,113.66) v1(47.55,112.81) v1(47.79,111.21) v1(47.79,110.36) v1(48.12,50.47) v1(48.12,49.62) v1(48.17,33.59) v1(48.17,32.74) v1(49.77,39.11) v1(49.89,82.49) v1(49.89,81.59) v1(50.56,89.08) v1(50.56,88.18) v1(50.72,82.49) v1(50.72,81.64) v1(51.39,89.08) v1(51.39,88.23) v1(54.39,56.47) v1(54.39,55.57) v1(55.22,56.47) v1(55.22,55.62) v1(56.9,88.66) v1(56.9,87.76) v1(57.73,88.66) v1(57.73,87.81) v1(58.04,46.85) v1(58.04,45.95) v1(58.16,44.48) v1(58.16,43.58) v1(58.82,67.45) v1(58.82,66.55) v1(58.87,46.85) v1(58.87,46) v1(58.99,44.48) v1(58.99,43.63) v1(59.65,67.45) v1(59.65,66.6) v1(59.69,38.65) v1(59.69,37.75) v1(60.23,32.68) v1(60.23,31.78) v1(60.25,27.56) v1(60.25,26.66) v1(60.35,22.31) v1(60.35,21.41) v1(60.52,38.65) v1(60.52,37.8) v1(61.06,32.68) v1(61.06,31.83) v1(61.08,27.56) v1(61.08,26.71) v1(61.25,46.82) v1(61.25,45.92) v1(61.18,22.31) v1(61.18,21.46) v1(61.34,88.08) v1(61.34,87.18) v1(61.34,44.5) v1(61.34,43.6) v1(61.49,84.16) v1(61.49,83.26) v1(62.08,46.82) v1(62.08,45.97) v1(62.17,88.08) v1(62.17,87.23) v1(62.17,44.5) v1(62.17,43.65) v1(62.32,84.16) v1(62.32,83.31) v1(62.41,67.49) v1(62.41,66.59) v1(63.24,67.49) v1(63.24,66.64) v1(64.77,83.23) v1(64.77,82.33) v1(65.6,83.23) v1(65.6,82.38) v1(70.03,32.58) v1(70.03,31.68) v1(70.44,27.27) v1(70.44,26.37) v1(70.74,22.36) v1(70.74,21.46) v1(70.86,32.58) v1(70.86,31.73) v1(71.27,27.27) v1(71.27,26.42) v1(71.57,22.36) v1(71.57,21.51) v1(72.22,83.47) v1(72.22,82.57) v1(72.62,68.36) v1(72.62,67.46) v1(73.05,83.47) v1(73.05,82.62) v1(73.45,68.36) v1(73.45,67.51) v1(73.37,54.09) v1(73.37,53.19) v1(74.2,54.09) v1(74.2,53.24) v1(77.73,26.53) v1(77.73,25.63) v1(78.63,53.56) v1(78.63,52.66) v1(78.56,26.53) v1(78.56,25.68) v1(79.46,53.56) v1(79.46,52.71) v1(80.04,49.58) v1(80.04,48.68) v1(80.87,49.58) v1(80.87,48.73) v1(82.36,112.52) v1(82.36,111.62) v1(82.56,109.19) v1(82.56,108.29) v1(82.66,106.15) v1(82.66,105.25) v1(82.85,103.89) v1(82.85,102.99) v1(82.93,94.52) v1(82.93,93.62) v1(83.19,112.52) v1(83.19,111.67) v1(83.39,109.19) v1(83.39,108.34) v1(83.49,106.15) v1(83.49,105.3) v1(83.68,103.89) v1(83.68,103.04) v1(83.76,94.52) v1(83.76,93.67) v1(86.42,51.35) v1(86.42,50.45) v1(86.46,67.1) v1(86.46,66.2) v1(86.68,112.71) v1(86.68,111.81) v1(86.77,109.58) v1(86.77,108.68) v1(87.25,51.35) v1(87.25,50.5) v1(87.29,67.1) v1(87.29,66.25) v1(87.51,112.71) v1(87.51,111.86) v1(87.6,109.58) v1(87.6,108.73) v1(95.81,102.56) v1(95.81,101.66) v1(95.94,106.25) v1(95.94,105.35) v1(96.03,29.09) v1(96.03,28.19) v1(96.64,102.56) v1(96.64,101.71) v1(96.77,106.25) v1(96.77,105.4) v1(96.86,29.09) v1(96.86,28.24) v1(97,59.84) v1(97,58.94) v1(97.09,63.41) v1(97.09,62.51) v1(97.83,59.84) v1(97.83,58.99) v1(97.92,63.41) v1(97.92,62.56)
595DS: length 47.5
  Top Layer w0.152: U1.3 28.69,108.93 32.92,108.93 34.75,107.1 v1(34.75,80.89)
  Bottom Layer w0.152: v1(34.75,80.89) 47.3,80.89 47.35,80.94 U19.14
595SHCP: length 30
  Top Layer w0.152: v1(31.35,77.14) 31.35,89.54 30.99,89.9 29.94,89.9
  Bottom Layer w0.152: U19.11 47.34,77.14 v1(31.35,77.14)
595STCP: length 20.4
  Top Layer w0.152: 50.62,60.9 50.62,68.6 v1(50.62,68.61)
  Bottom Layer w0.152: v1(50.62,68.61) 50.62,77.72 50.02,78.32 47.43,78.32 U19.12
BEEP: length 97.7
  Top Layer w0.152: v1(24.88,65.89) 30.07,65.89 30.75,65.21 30.75,40.3 v1(30.71,40.26) ; U1.15 25.24,94.98 24.86,94.6 v1(24.86,70.5)
  Bottom Layer w0.152: v1(30.71,40.26) 64.84,40.26 65,40.1 R41.2 ; v1(24.88,65.89) 24.88,66.33 24.88,66.34 24.88,66.78 24.86,66.8 v1(24.86,70.5)
DC12V: length 6.9
  Bottom Layer w0.762: DC1.1 85.23,25.55 84.68,26.1 82.69,26.1 F1.1
KEY1: length 122.1
  Top Layer w0.152: U1.24 72.23,108.97 41.43,108.97 40.48,108.02 40.48,105.75 39.7,104.97 38.35,104.97 36.86,103.48 36.86,31.16 37.97,30.05 KEY1.3
  Bottom Layer w0.152: KEY1.3 38.9,30 R54.2 35.53,30.05 KEY1.4
KEY2: length 118.6
  Top Layer w0.152: v1(39.06,66.15) 39.06,97.63 40.31,98.88 70.39,98.88 70.43,98.84 72.26,98.84 U1.32 ; 46.94,66.17 46.94,56.91 46.49,56.46 46.49,32.38 KEY2.3
  Bottom Layer w0.152: v1(46.95,66.16) 39.07,66.16 v1(39.06,66.15) ; KEY2.4 45.45,30.05 R55.2 48.82,30.05 KEY2.3
KEY3: length 99.5
  Top Layer w0.152: 32.39,23.21 KEY3.4 KEY3.3 ; 32.39,23.21 31.6,23.21 30.76,24.05 30.76,31.74 31.4,32.38 v1(31.79,32.38) ; 32.39,23.21 32.97,23.21 ; U1.13 25.11,97.52 24.12,96.53 24.12,69.75 v1(24.11,69.74) ; v1(24.35,66.56) 30.81,66.56 31.79,65.58 v1(31.79,35.7)
  Bottom Layer w0.152: v1(24.35,66.56) 24.11,66.8 v1(24.11,69.74) ; KEY3.3 38.92,23.24 R56.2 35.58,23.27 KEY3.4 ; v1(31.79,32.38) v1(31.79,35.7)
KEY4: length 43.9
  Top Layer w0.152: KEY4.4 43.79,23.27 44.24,23.72 44.24,30.75 45.54,32.04 U1.50
  Bottom Layer w0.152: 45.41,23.26 48.81,23.26 KEY4.3 ; KEY4.4 45.43,23.27 R57.2
M1_E1: length 76.6
  Top Layer w0.152: U1.21 68.39,115.31 11.21,115.31 10.39,114.49 10.39,103.07 9.23,101.91 7.67,101.91 7.64,101.94
M1_E2: length 77.9
  Top Layer w0.152: v1(45.47,72.05) 44.02,72.05 43.34,72.73 43.34,89.51 v1(43.36,89.53) ; v1(21.72,101.3) 14.51,101.3 13.77,100.56 9.64,100.56 8.52,99.44 7.64,99.44 ; U1.49 45.54,63.15 45.63,63.25 45.63,68.65 v1(45.5,68.79)
  Bottom Layer w0.152: v1(45.47,72.05) 45.5,72.02 v1(45.5,68.79) ; v1(43.36,89.53) 43.36,99.87 41.89,101.34 21.76,101.34 v1(21.72,101.3)
M1_IN1: length 29.8
  Bottom Layer w0.152: U3.14 41.34,83.94 43.09,82.19 U19.15
M1_IN2: length 42
  Bottom Layer w0.152: U19.1 54.82,83.46 55.21,83.85 55.21,86.24 54.88,86.57 18.4,86.57 U3.15
M1_O1: length 29.6
  Top Layer w0.762: 7.64,106.94 5.99,106.94 4.68,105.63 4.68,82.19 3.89,81.4 U3.4
M1_O2: length 19.9
  Top Layer w0.762: U3.5 2.34,78.89 5.86,78.89 6.78,79.81 6.78,93.58 7.64,94.44
M1_PWM: length 44.7
  Top Layer w0.152: v1(27.96,73.65) 26.28,73.65 25.74,74.19 v1(25.74,88.99)
  Bottom Layer w0.152: v1(25.74,88.99) 18.33,88.99 U3.16 ; v1(27.96,73.65) 27.96,61.19 28.25,60.9 U1.41
M2_E1: length 97
  Top Layer w0.152: v1(41.65,68.9) 41.67,68.92 41.67,92.53 42.88,93.74 72.24,93.74 U1.36 ; 7.78,60.79 7.8,60.81 17.98,60.81 18.78,61.61 18.78,67.29 20.37,68.88 v1(33.62,68.88)
  Bottom Layer w0.152: v1(33.62,68.88) 33.64,68.9 v1(41.65,68.9)
M2_E2: length 102.5
  Top Layer w0.152: v1(33.69,67.48) 21.31,67.48 19.8,65.97 19.8,58.96 19.07,58.23 7.84,58.23 7.78,58.29 ; v1(40.72,67.5) 40.62,67.6 40.62,95.24 41.58,96.2 72.16,96.2 U1.34
  Bottom Layer w0.152: v1(40.72,67.5) 33.71,67.5 v1(33.69,67.48)
M2_IN1: length 46.4
  Top Layer w0.152: 57.11,82.21 57.22,82.1 57.22,79.18 56.91,78.87 v1(44.95,78.87)
  Bottom Layer w0.152: v1(44.95,78.87) 44.94,78.86 U3.12 ; U19.2 52.85,82.21 v1(57.1,82.21)
M2_IN2: length 48.4
  Top Layer w0.152: v1(58.16,80.95) 58.14,80.93 58.14,78.67 57.47,78 v1(44.3,78)
  Bottom Layer w0.152: v1(58.16,80.95) 52.86,80.95 U19.3 ; v1(44.3,78) 44.29,78.01 27.52,78.01 25.83,76.32 U3.11
M2_O1: length 21.1
  Top Layer w0.762: U3.6 9.62,76.32 10.86,75.08 10.86,66.41 10.24,65.79 7.78,65.79
M2_O2: length 25.3
  Top Layer w0.762: U3.7 4.88,73.78 5.42,73.24 5.42,53.85 5.95,53.32 7.75,53.32 7.78,53.29
M2_PWM: length 41.6
  Top Layer w0.152: v1(48.09,68.87) 48.08,68.85 U1.51 ; v1(29.24,72.7) 25.59,72.7 v1(25.58,72.71)
  Bottom Layer w0.152: 47.43,72.7 48.09,72.04 v1(48.09,68.87) ; v1(25.58,72.71) 19.38,72.71 U3.10 ; 47.42,72.7 v1(29.24,72.7)
M3_E1: length 106.5
  Top Layer w0.152: v1(34.24,70.13) 34.09,70.28 34.09,105.85 32.26,107.68 29.94,107.68 ; v1(43.32,70.12) 77.22,70.12 80.67,66.67 80.67,61.51 83.91,58.27 92.01,58.27 92.05,58.3
  Bottom Layer w0.152: v1(34.24,70.13) 43.31,70.13 v1(43.32,70.12)
M3_E2: length 101.1
  Top Layer w0.152: 92.05,60.8 92.05,60.81 82.59,60.81 81.43,61.97 81.43,67.32 v1(80.56,68.19) ; v1(77.21,68.23) 75.96,69.48 v1(43.91,69.48) ; 29.94,102.6 31.23,102.6 32.48,101.35 32.48,69.74 v1(32.7,69.52)
  Bottom Layer w0.152: v1(77.21,68.23) 77.25,68.19 v1(80.56,68.19) ; v1(32.7,69.52) 43.87,69.52 v1(43.91,69.48)
M3_IN1: length 46.5
  Top Layer w0.152: v1(78.26,82.73) 96.17,82.73 U4.14
  Bottom Layer w0.152: 52.84,79.65 72.78,79.65 75.85,82.73 v1(78.26,82.73)
M3_IN2: length 51.4
  Top Layer w0.152: v1(78.93,84.8) 79.44,85.31 96.21,85.31 U4.15
  Bottom Layer w0.152: U19.5 52.85,78.37 78.12,78.37 78.93,79.18 v1(78.93,84.8)
M3_O1: length 42.3
  Top Layer w0.762: v2(94.12,79.1) 94.09,79.13 94.09,80.83 93.4,81.52 U4.4
  Bottom Layer w0.762: 92.05,53.3 92.08,53.28 93.66,53.28 94.12,53.74 v2(94.12,79.1)
M3_O2: length 23.8
  Top Layer w0.762: v2(92.12,78.99) 92.11,78.98 U4.5
  Bottom Layer w0.762: 92.05,65.8 92.12,65.87 v2(92.12,78.99)
M3_PWM: length 73.1
  Top Layer w0.152: U1.56 53.96,58.36 54.44,58.84 v1(54.44,68.48) ; v1(76.82,87.77) 76.48,87.43 76.48,73.9 75.2,72.62 v1(54.44,72.62) ; v1(78.2,87.79) 92.99,87.79 94.34,89.14 U4.16
  Bottom Layer w0.152: v1(76.82,87.77) 78.18,87.77 v1(78.2,87.79) ; v1(54.44,68.48) v1(54.44,72.62)
M4_E1: length 90.5
  Top Layer w0.152: v1(44.75,63.45) 44.75,63.45 44.75,68.73 v1(44.6,68.89) ; v1(44.59,71.5) 76.57,71.5 77.54,72.47 77.54,97.65 79.28,99.39 92.28,99.39 92.29,99.39
  Bottom Layer w0.152: 40.46,58.36 41.55,59.45 ; 41.55,59.45 41.55,62.8 42.18,63.43 44.73,63.43 v1(44.75,63.45) ; 41.55,59.45 41.55,59.45 ; v1(44.59,71.5) 44.59,68.9 v1(44.6,68.89)
M4_E2: length 22.1
  Top Layer w0.152: U1.31 72.19,101.31 91.7,101.31 92.29,101.89
M4_IN1: length 45.4
  Top Layer w0.152: v1(78.6,77.64) 96.16,77.64 U4.12
  Bottom Layer w0.152: v1(78.6,77.64) 55.28,77.64 54.78,77.14 52.86,77.14 U19.6
M4_IN2: length 45.4
  Top Layer w0.152: v1(78.46,75.23) 96.29,75.23 U4.11
  Bottom Layer w0.152: v1(78.46,75.23) 77.84,75.84 U19.7
M4_O1: length 28.5
  Top Layer w0.762: U4.6 81.69,76.25 v2(89.95,76.25)
  Bottom Layer w0.762: 92.29,94.39 90.8,94.39 90.04,93.63 90.04,76.34 v2(89.95,76.25)
M4_O2: length 43
  Top Layer w0.762: U4.7 81.52,73.92 v2(87.09,73.92)
  Bottom Layer w0.762: 92.29,106.89 88.5,106.89 87.09,105.49 v2(87.09,73.92)
M4_PWM: length 102.4
  Top Layer w0.152: v1(33.06,70.77) 33.06,103.84 31.76,105.14 29.94,105.14 ; v1(43.77,70.79) 77.88,70.79 79.67,72.58 95.78,72.58 97.1,73.9 U4.10
  Bottom Layer w0.152: v1(33.06,70.77) 43.76,70.79
OLED_CS: length 125.2
  Top Layer w0.152: v1(34.53,33.54) 34,33.01 23.64,33.01 23.09,32.46 U11.7 ; U1.29 38.51,102.6 37.73,101.82 37.73,64.84 39.02,63.55 v1(39.02,33.53)
  Bottom Layer w0.152: v1(34.53,33.54) 34.54,33.53 v1(39.02,33.53)
OLED_DC: length 129.7
  Top Layer w0.152: v1(41.85,106.37) 41.86,106.38 72.18,106.38 U1.26 ; v1(38.93,106.37) 35.89,103.33 35.89,66.09 33.99,64.19 33.99,35.52 32.21,33.74 20.83,33.74 20.53,33.44 20.53,26.03 U11.6
  Bottom Layer w0.152: v1(41.85,106.37) v1(38.93,106.37)
OLED_RST: length 122.5
  Top Layer w0.152: U1.40 72.24,91.14 43.11,91.14 42.57,90.6 42.57,65.95 44.18,64.34 44.18,32.16 v1(44.14,32.12)
  Bottom Layer w0.152: U11.5 17.98,26.04 17.98,31.09 18.69,31.8 43.82,31.8 v1(44.14,32.12)
OLED_SCL: length 88.5
  Top Layer w0.152: U11.3 12.96,26.03 12.96,34.31 13.79,35.14 29.19,35.14 29.99,35.94 v1(29.99,64.22) ; 29.94,94.98 31.54,94.98 31.92,94.6 31.92,69.58 v1(31.91,69.57)
  Bottom Layer w0.152: v1(31.91,69.57) 31.91,64.71 31.39,64.19 30.26,64.19 30.25,64.2 30.01,64.2 v1(29.99,64.22)
OLED_SDA: length 133.7
  Top Layer w0.152: 15.47,26.01 15.47,33.45 16.49,34.47 31.89,34.47 33.02,35.6 33.02,65.04 35.31,67.33 35.31,103.7 v1(35.47,103.86) ; U1.28 72.2,103.86 38.92,103.86 v1(38.91,103.87)
  Bottom Layer w0.152: v1(35.47,103.86) 35.48,103.87 v1(38.91,103.87)
RX1: length 50.6
  Top Layer w0.152: U21.3 24.83,43.59 26.23,43.59 28.95,46.31 v1(28.95,55.35) v1(28.95,61.92) ; v1(30.23,70.43) 30.22,70.44 30.22,87.07 U1.19
  Bottom Layer w0.152: v1(28.95,61.92) 28.95,65.02 30.23,66.3 v1(30.23,70.43)
SCL1: length 48
  Top Layer w0.152: 60.78,58.02 60.78,58.36 61.48,58.36 61.82,58.02 61.82,56.45 62.16,56.11 81.68,56.11 83.13,54.65 83.13,46.78 84.68,45.23 90.75,45.23 R7.2 96.91,44.14 U18.3
SCL2: length 88.3
  Top Layer w0.152: v1(22.59,69.92) 22.6,69.93 22.6,103.66 24.08,105.14 U1.7 ; H1.5 4.72,39.51 R9.2 ; 4.76,39.49 17.14,39.49 19.13,41.48 v1(19.13,55.31)
  Bottom Layer w0.152: v1(22.59,69.92) 22.59,62.72 22.14,62.27 19.88,62.27 19.13,61.52 v1(19.13,55.31)
SDA1: length 48
  Top Layer w0.152: U1.64 62.57,58.36 62.22,58.01 62.22,56.68 62.49,56.41 81.8,56.41 83.44,54.77 83.44,46.91 84.81,45.54 90.74,45.54 R8.2 92.98,46.64 92.99,46.63 93.71,46.63 arc(94,46.75) 94.12,47.04 arc(94.24,47.33) 94.53,47.45 95.23,47.45 arc(95.52,47.33) 95.64,47.04 arc(95.76,46.75) 96.05,46.63 96.91,46.64 U18.4
SDA2: length 88.5
  Top Layer w0.152: 4.81,42.03 5.76,42.01 arc(6.3,42.23) 6.52,42.77 6.52,43.06 arc(7.28,43.82) 8.05,43.06 8.05,42.77 arc(8.81,42.01) 9.57,42.77 9.57,43.06 arc(10.33,43.82) 11.09,43.06 11.09,42.77 arc(11.32,42.23) 11.86,42.01 14.84,42.01 14.86,42.03 17.26,42.03 18.11,42.88 18.11,55.88 18.48,56.25 v1(19.9,56.25) ; v1(23.4,69.86) 23.4,101.54 24.46,102.6 U1.9 ; H1.6 4.73,42.05 R10.2
  Bottom Layer w0.152: v1(19.9,56.25) 19.9,60.79 20.72,61.61 22.96,61.61 23.4,62.05 v1(23.4,69.86)
TX1: length 49.3
  Top Layer w0.152: U21.2 24.84,46.08 26.11,46.08 26.74,46.71 v1(26.74,56.09) ; v1(26.71,74.77) 28.71,76.77 v1(28.71,87.45)
  Bottom Layer w0.152: U1.17 28.71,91.12 v1(28.71,87.45) ; v1(26.74,56.09) 26.71,56.12 v1(26.71,74.77)
$1N3300: length 3.7
  Bottom Layer w0.152: U3.13 18.28,81.42 R1.1
$1N3306: length 3.5
  Bottom Layer w0.152: U4.13 97.49,81.51 R2.1
$1N3954: length 2.6
  Bottom Layer w0.152: R3.1 45.53,74.21 45.9,74.57 47.36,74.57
$1N3999: length 2.5
  Bottom Layer w0.152: U19.10 45.12,75.84 R4.1
$1N4038: length 2.5
  Bottom Layer w0.152: R5.1 45.66,79.88 45.89,79.65 47.36,79.65 47.36,79.65
$1N7178: length 3.9
  Bottom Layer w0.152: Q1.1 69.64,38.59 R46.2 R41.1
$1N9172: length 1.8
  Top Layer w0.762: R58.1 51.02,32.92 51.03,32.94
$1N14610: length 4.1
  Bottom Layer w0.762: F1.2 86.03,28.97 SW1.3
$1N14720: length 5.8
  Top Layer w0.152: BUZZER3.1 75.06,44.41 69.29,44.41
$1N14723: length 3.5
  Bottom Layer w0.152: Q1.3 75.07,39.51 BUZZER3.2
$1N15095: length 1.6
  Top Layer w0.3: LED3.2 55.97,46.46 R59.1
$1N17140: length 5.1
  Top Layer w0.762: F2.2 55.26,38.99 C6.2 53.26,42.04 U27.3

## Copper pours and planes (outline as drawn; the poured copper is in the pictures)
GND on Top Layer: -15.34,126.55 111.29,126.55 111.29,4.61 -15.34,4.61
GND on Bottom Layer: -18.69,134.98 123.28,134.98 123.28,2.6 -18.69,2.6

Small or netless copper shapes (teardrops, artwork), in the pictures only: 220 on Top Layer, 191 on Bottom Layer

## Text on the board
Top Silkscreen Layer: SDA2 | SCL2 | GND | 3V3 | SCL | SDA | RST | DC | CS | 3v3 | M1_E1 | M1_01 | M2_01 | M2_E1 | M1_02 | M1_E2 | 5V | M2_02 | M2_E2 | RX1 | TX1 | M3_E1 | M3_01 | M4_E1 | M4_01 | M3_02 | SCL1 | SDA1 | M3_E2 | M4_02 | M4_E2 | mpu6050 | 蜂鸣器 | 电源开关 | 12vDC座 | oled屏幕 | 左后 | 左前 | 串口 | 右后 | 右前
